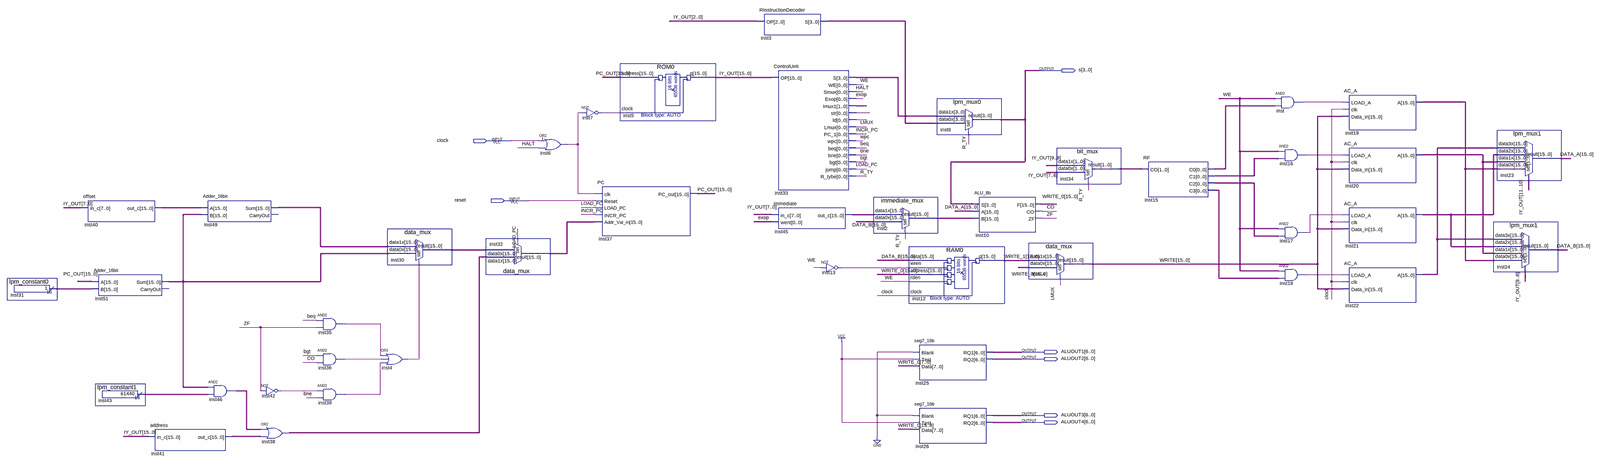
[diagram p0: schematic sheet, whole]
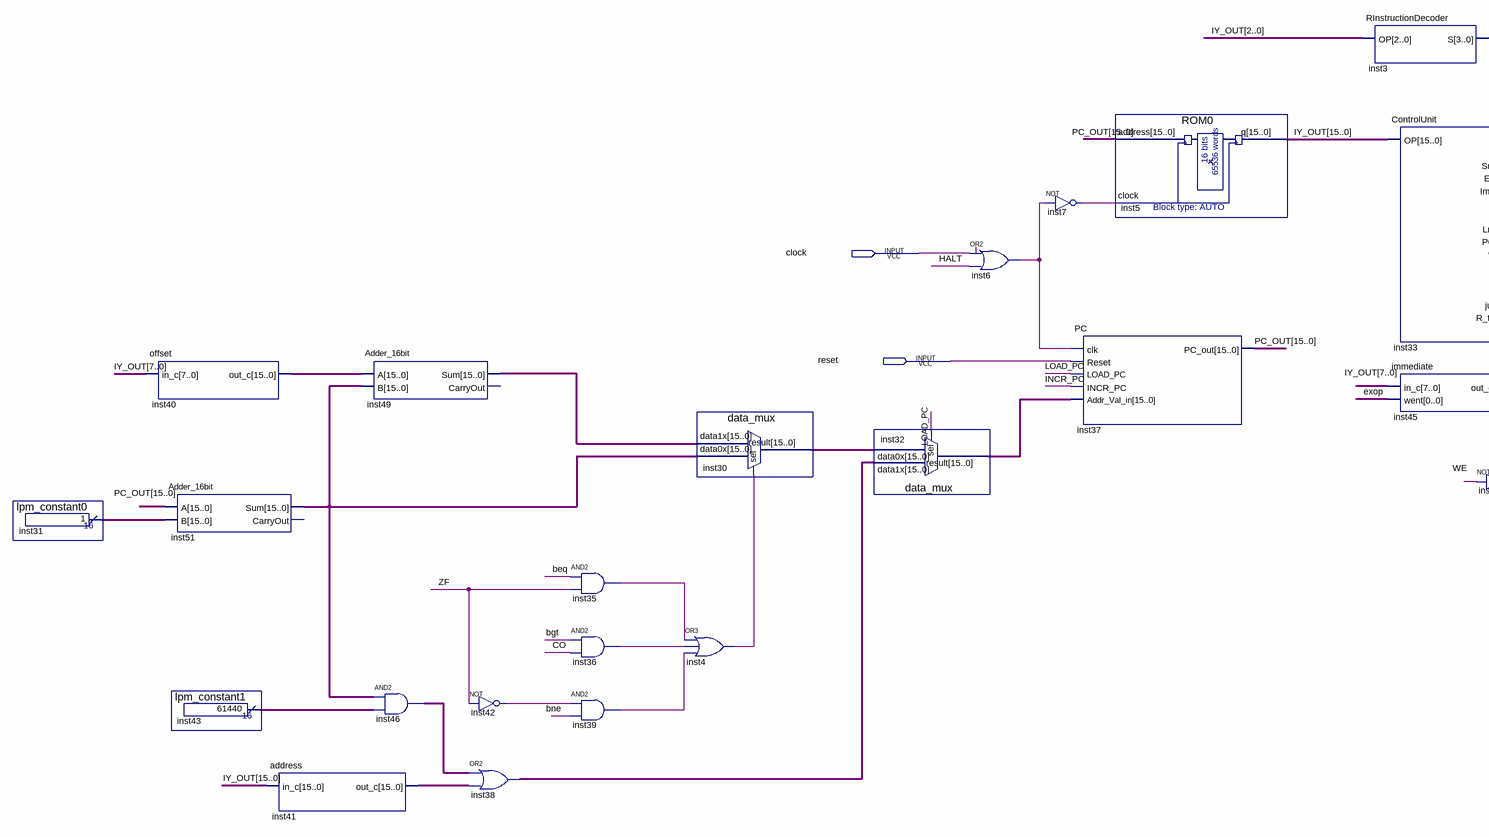
[diagram p1: schematic sheet, left part]
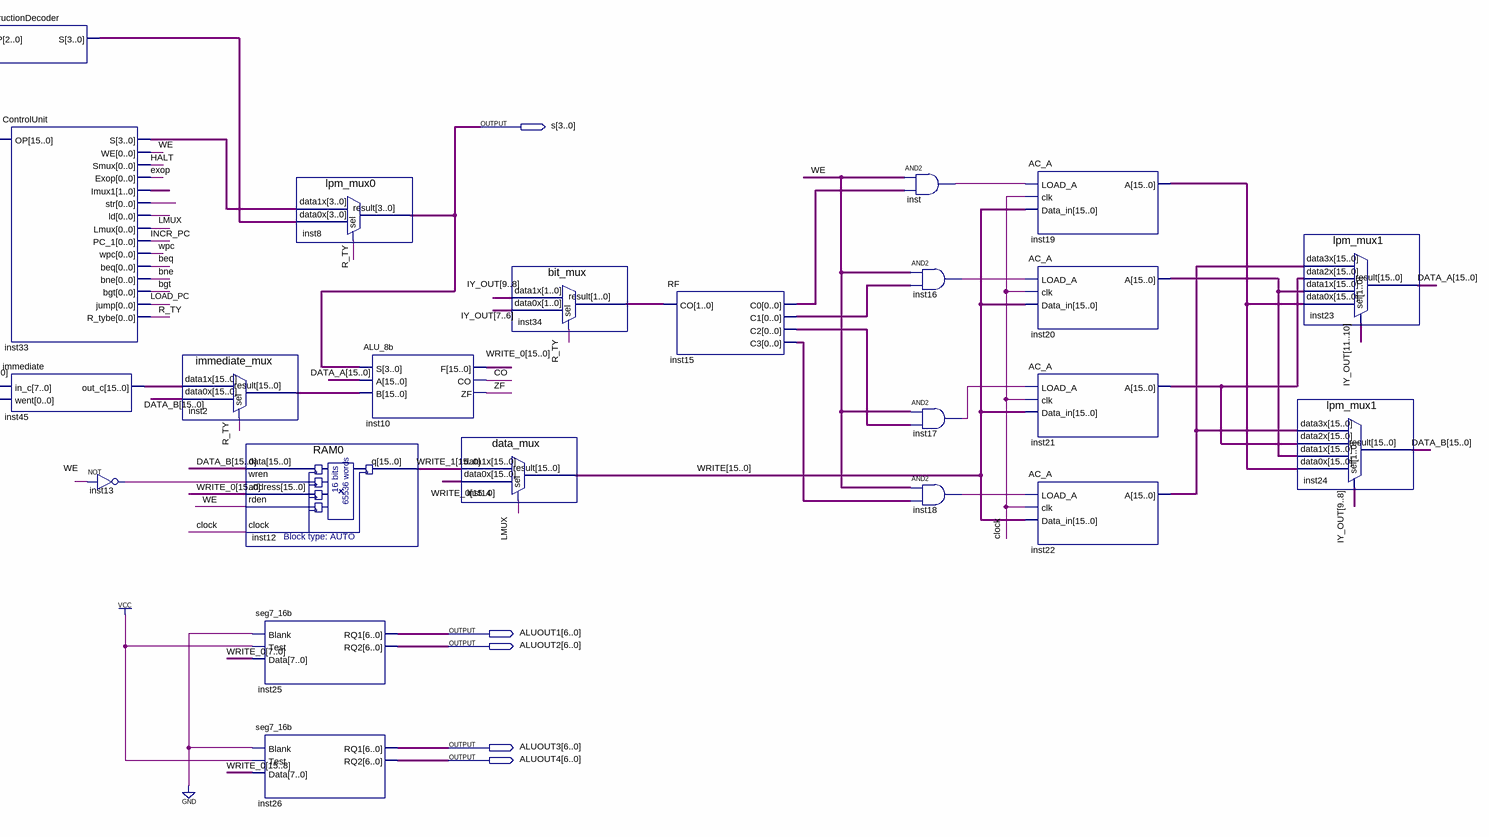
[diagram p2: schematic sheet, right part]
// Quartus schematic computer.bdf as structural Verilog: 42 symbols, 7 pins
module computer (
  input  clock,
  input  reset,
  output [3:0] s,
  output [6:0] ALUOUT1,
  output [6:0] ALUOUT2,
  output [6:0] ALUOUT3,
  output [6:0] ALUOUT4
);

  wire beq, bgt, bne, CO, exop, HALT, INCR_PC, inst4_out, inst6_out, inst7_out, inst13_out, inst15_c0,
       inst15_c1, inst15_c2, inst15_c3, inst16_out, inst17_out, inst18_out, inst33_ld, inst33_str,
       inst35_out, inst36_out, inst39_out, inst42_out, inst_out, LMUX, LOAD_PC, R_TY, WE, wpc, ZF;
  wire [1:0] inst33_imux1, inst34_result;
  wire [3:0] inst3_s, inst33_s;
  wire [15:0] DATA_A, DATA_B, inst2_result, inst19_a, inst20_a, inst21_a, inst22_a, inst30_result,
       inst31_result, inst32_result, inst38_out, inst40_out_c, inst41_out_c, inst43_result, inst45_out_c,
       inst46_out, inst49_sum, inst51_sum, IY_OUT, PC_OUT, WRITE, WRITE_0, WRITE_1;

  lpm_constant0 inst31 (.result(inst31_result));
  offset inst40 (.in_c(IY_OUT[7:0]), .out_c(inst40_out_c));
  Adder_16bit inst51 (.A(PC_OUT), .B(inst31_result), .Sum(inst51_sum));  // open: CarryOut
  lpm_constant1 inst43 (.result(inst43_result));
  address inst41 (.in_c(IY_OUT), .out_c(inst41_out_c));
  Adder_16bit inst49 (.A(inst40_out_c), .B(inst51_sum), .Sum(inst49_sum));  // open: CarryOut
  assign inst46_out = inst51_sum & inst43_result;  // AND2 inst46, 16 bits wide
  not inst42 (inst42_out, ZF);
  assign inst38_out = inst46_out | inst41_out_c;  // OR2 inst38, 16 bits wide
  and inst35 (inst35_out, beq, ZF);
  and inst36 (inst36_out, bgt, CO);
  and inst39 (inst39_out, inst42_out, bne);
  data_mux inst30 (.data1x(inst49_sum), .data0x(inst51_sum), .sel(inst4_out), .result(inst30_result));
  or inst4 (inst4_out, inst35_out, inst36_out, inst39_out);
  data_mux inst32 (.data1x(inst38_out), .data0x(inst30_result), .sel(LOAD_PC), .result(inst32_result));
  or inst6 (inst6_out, clock, HALT);
  not inst7 (inst7_out, inst6_out);
  PC inst37 (
    .clk(inst6_out), .Reset(reset), .LOAD_PC(LOAD_PC), .INCR_PC(INCR_PC), .Addr_Val_in(inst32_result),
    .PC_out(PC_OUT));
  ROM0 inst5 (.address(PC_OUT), .clock(inst7_out), .q(IY_OUT));
  RInstructionDecoder inst3 (.OP(IY_OUT[2:0]), .S(inst3_s));
  ControlUnit inst33 (
    .OP(IY_OUT), .S(inst33_s), .WE(WE), .Smux(HALT), .Exop(exop), .Imux1(inst33_imux1), .str(inst33_str),
    .ld(inst33_ld), .Lmux(LMUX), .PC_1(INCR_PC), .wpc(wpc), .beq(beq), .bne(bne), .bgt(bgt), .jump(LOAD_PC),
    .R_tybe(R_TY));
  immediate inst45 (.in_c(IY_OUT[7:0]), .went(exop), .out_c(inst45_out_c));
  not inst13 (inst13_out, WE);
  immediate_mux inst2 (.data1x(inst45_out_c), .data0x(DATA_B), .sel(R_TY), .result(inst2_result));
  RAM0 inst12 (.data(DATA_B), .wren(inst13_out), .address(WRITE_0), .rden(WE), .clock(clock), .q(WRITE_1));
  seg7_16b inst25 (.Blank(1'b0), .Test(1'b1), .Data(WRITE_0[7:0]), .RQ1(ALUOUT1), .RQ2(ALUOUT2));
  seg7_16b inst26 (.Blank(1'b0), .Test(1'b1), .Data(WRITE_0[15:8]), .RQ1(ALUOUT3), .RQ2(ALUOUT4));
  lpm_mux0 inst8 (.data1x(inst33_s), .data0x(inst3_s), .sel(R_TY), .result(s));
  ALU_8b inst10 (.S(s), .A(DATA_A), .B(inst2_result), .F(WRITE_0), .CO(CO), .ZF(ZF));
  data_mux inst14 (.data1x(WRITE_1), .data0x(WRITE_0), .sel(LMUX), .result(WRITE));
  bit_mux inst34 (.data1x(IY_OUT[9:8]), .data0x(IY_OUT[7:6]), .sel(R_TY), .result(inst34_result));
  RF inst15 (.CO(inst34_result), .C0(inst15_c0), .C1(inst15_c1), .C2(inst15_c2), .C3(inst15_c3));
  and inst (inst_out, WE, inst15_c0);
  and inst16 (inst16_out, WE, inst15_c1);
  and inst17 (inst17_out, WE, inst15_c2);
  and inst18 (inst18_out, WE, inst15_c3);
  AC_A inst19 (.LOAD_A(inst_out), .clk(clock), .Data_in(WRITE), .A(inst19_a));
  AC_A inst20 (.LOAD_A(inst16_out), .clk(clock), .Data_in(WRITE), .A(inst20_a));
  AC_A inst21 (.LOAD_A(inst17_out), .clk(clock), .Data_in(WRITE), .A(inst21_a));
  AC_A inst22 (.LOAD_A(inst18_out), .clk(clock), .Data_in(WRITE), .A(inst22_a));
  lpm_mux1 inst23 (
    .data3x(inst22_a), .data2x(inst21_a), .data1x(inst20_a), .data0x(inst19_a), .sel(IY_OUT[11:10]),
    .result(DATA_A));
  lpm_mux1 inst24 (
    .data3x(inst22_a), .data2x(inst21_a), .data1x(inst20_a), .data0x(inst19_a), .sel(IY_OUT[9:8]),
    .result(DATA_B));
endmodule
